# EAGLE schematic jtag-adapter-1-5 (EAGLE 8.4.3)
AUTHOR: Balazs Racz; DRAWING_TITLE: SWD adaptor board; REVISION: A; YEAR: 2018
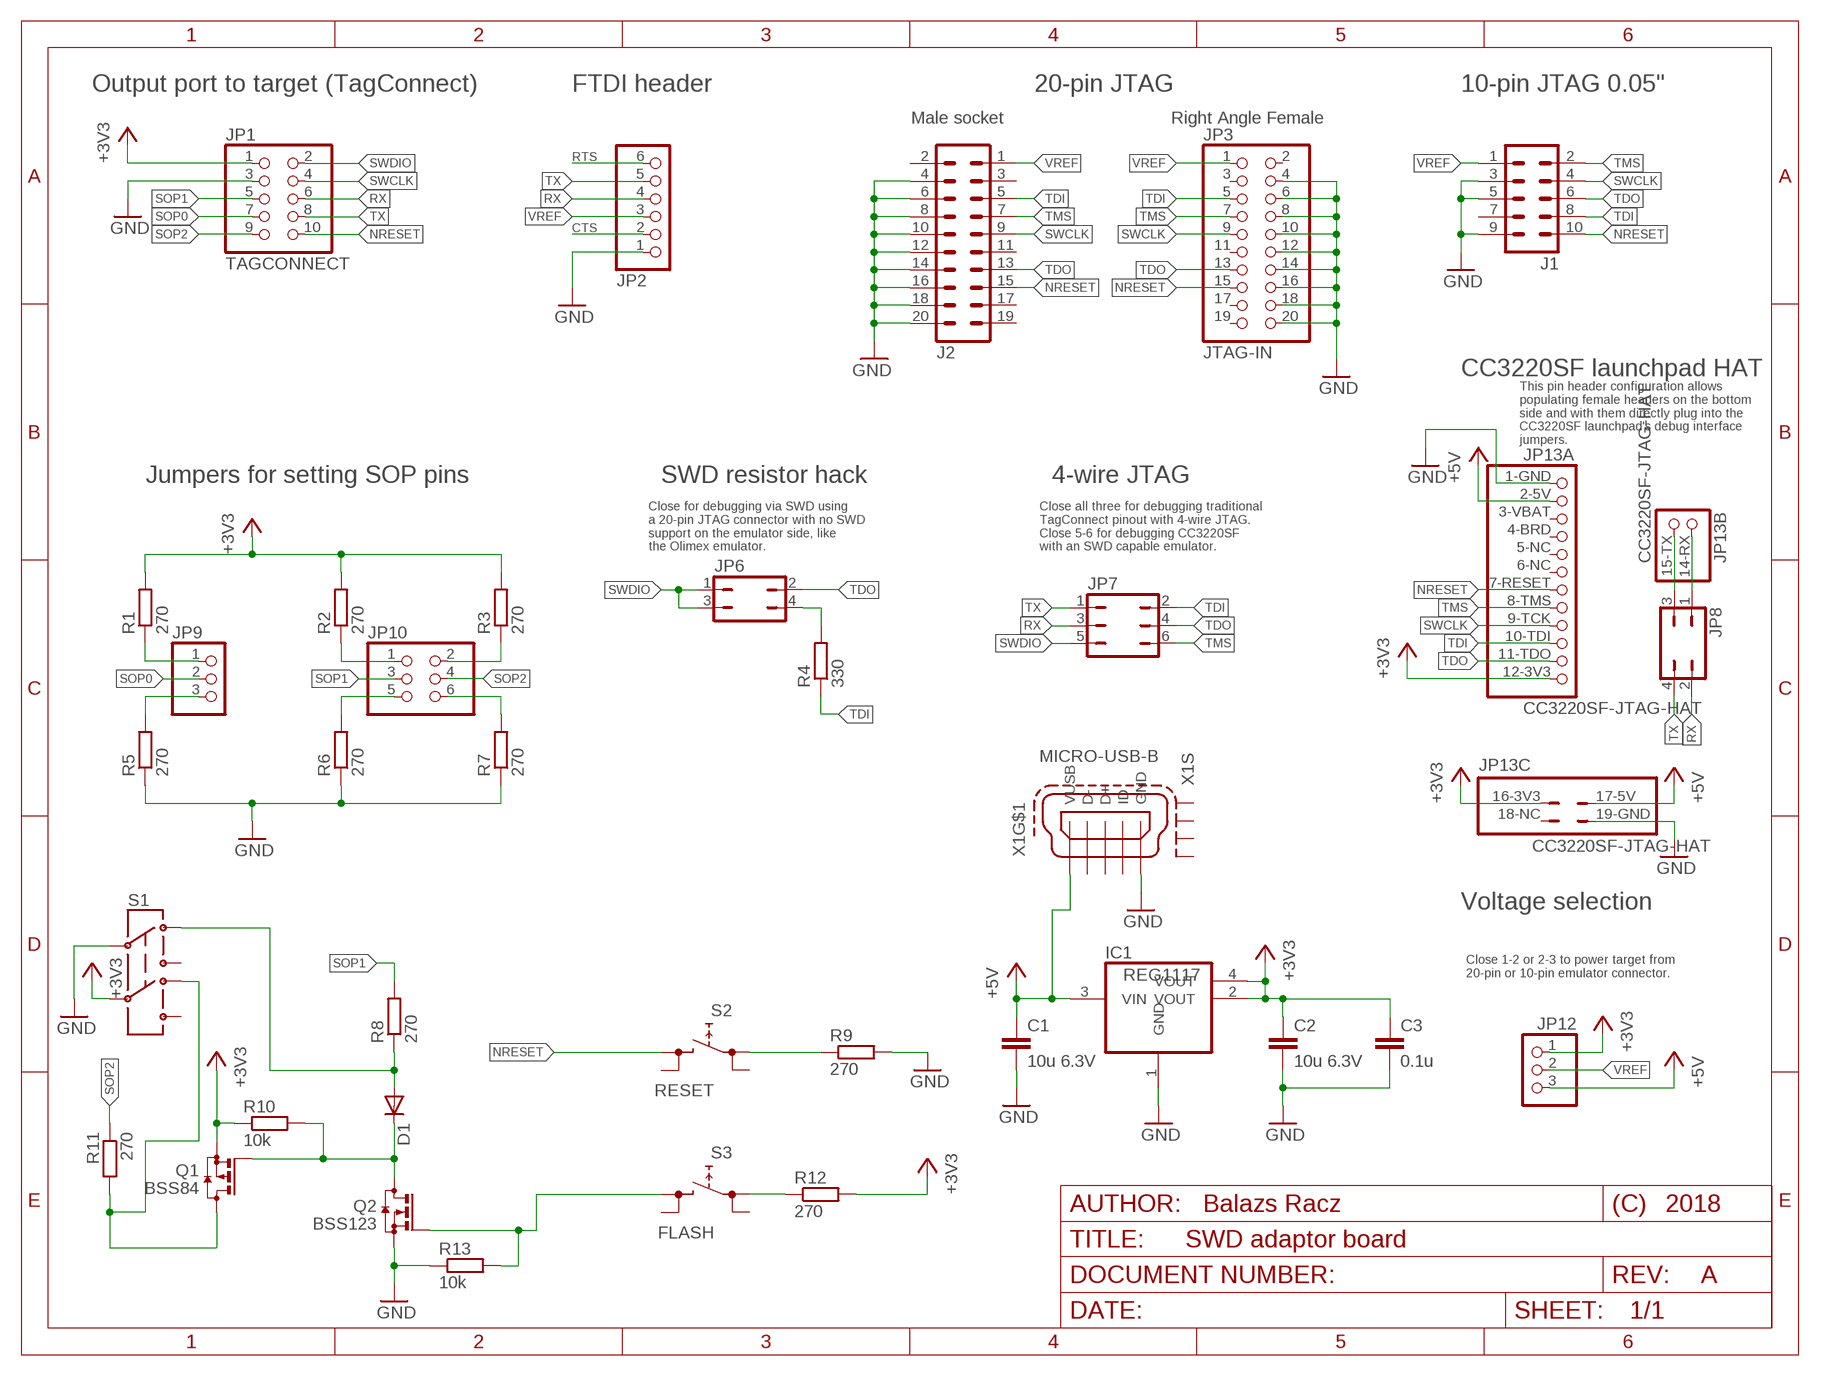
[diagram p0: schematic, sheet 1]

## Parts
C1  10u 6.3V  C-EUC0603K  [C0603K]
C2  10u 6.3V  C-EUC0603K  [C0603K]
C3  0.1u  C-EUC0603K  [C0603K]
D1  DIODE-MINIMELF  [MINIMELF]
IC1  REG1117  [SOT223]
J1  MA05-2_0.05X0.05  [MA05-2_0.05_X_0.05]
J2  MA10-2S  [MA10-2-SHROUDED]
JP1  TAGCONNECT  PINHD-2X5CN  [CON10M]
JP2  PINHD-1X6  [1X06]
JP3  JTAG-IN  PINHD-2X10/90  [2X10/90]
JP6  JP2Q  [JP2Q]
JP7  JP3Q  [JP3Q]
JP8  JP2Q  [JP2Q]
JP9  PINHD-1X3  [1X03]
JP10  PINHD-2X3  [2X03]
JP12  PINHD-1X3  [1X03]
JP13  CC3220SF-JTAG-HAT  [JTAG-LAUNCHPAD-3220SF]
Q1  BSS84  [SOT23]
Q2  BSS123  [SOT23]
R1  270  R-EU_R0805  [R0805]
R2  270  R-EU_R0805  [R0805]
R3  270  R-EU_R0805  [R0805]
R4  330  R-EU_R0805  [R0805]
R5  270  R-EU_R0805  [R0805]
R6  270  R-EU_R0805  [R0805]
R7  270  R-EU_R0805  [R0805]
R8  270  R-EU_R0805  [R0805]
R9  270  R-EU_R0805  [R0805]
R10  10k  R-EU_R0805  [R0805]
R11  270  R-EU_R0805  [R0805]
R12  270  R-EU_R0805  [R0805]
R13  10k  R-EU_R0805  [R0805]
S1  SWITCH-DPDTJS202011CQN  [DPDT-2.5X3.2MM]
S2  RESET  TACTSW-6X6S  [TACTSW-6X6]
S3  FLASH  TACTSW-6X6S  [TACTSW-6X6]
X1  MICRO-USB-B  [MICRO-B-PAC]

## Nets
+3V3: C2.1 C3.1 IC1.2(VOUT) IC1.4(VOUT) JP1.1 JP12.1 JP13.12-3V3 JP13.16-3V3 Q1.2(S) R1.2 R2.2 R3.2 R10.1 R12.2 S1.5(2C)
+5V: C1.1 IC1.3(VIN) JP12.3 JP13.2-5V JP13.17-5V X1.1(VUSB)
CTS: JP2.2
GND: C1.2 C2.2 C3.2 IC1.1(GND) J1.3 J1.5 J1.9 J2.4 J2.6 J2.8 J2.10 J2.12 J2.14 J2.16 J2.18 J2.20 JP1.3 JP2.1 JP3.4 JP3.6 JP3.8 JP3.10 JP3.12 JP3.14 JP3.16 JP3.18 JP3.20 JP13.1-GND JP13.19-GND Q2.2(S) R5.1 R6.1 R7.1 R9.2 R13.1 S1.2(1C) X1.5(GND)
N$1: R9.1 S2.1(1.1)
N$4: JP6.4 R4.2
N$9: D1.C Q1.1(G) Q2.3(D) R10.2
N$10: R12.1 S3.1(1.1)
N$11: Q2.1(G) R13.2 S3.3(2.1)
N$13: Q1.3(D) R11.2 S1.4(2A)
N$14: JP8.1 JP13.14-RX
N$15: JP8.3 JP13.15-TX
N$16: D1.A R8.1 S1.1(1A)
NRESET: J1.10 J2.15 JP1.10 JP3.15 JP13.7-RESET S2.3(2.1)
RTS: JP2.6
RX: JP1.6 JP2.4 JP7.3 JP8.2
SOP0: JP1.7 JP9.2
SOP0H: JP9.1 R1.1
SOP0L: JP9.3 R5.2
SOP1: JP1.5 JP10.3 R8.2
SOP1H: JP10.1 R2.1
SOP1L: JP10.5 R6.2
SOP2: JP1.9 JP10.4 R11.1
SOP2H: JP10.2 R3.1
SOP2L: JP10.6 R7.2
SWCLK: J1.4 J2.9 JP1.4 JP3.9 JP13.9-TCK
SWDIO: JP1.2 JP6.1 JP6.3 JP7.5
TDI: J1.8 J2.5 JP3.5 JP7.2 JP13.10-TDI R4.1
TDO: J1.6 J2.13 JP3.13 JP6.2 JP7.4 JP13.11-TDO
TMS: J1.2 J2.7 JP3.7 JP7.6 JP13.8-TMS
TX: JP1.8 JP2.5 JP7.1 JP8.4
VREF: J1.1 J2.1 JP2.3 JP3.1 JP12.2
Unconnected: J1.7 J2.2 J2.3 J2.11 J2.17 J2.19 JP3.2 JP3.3 JP3.11 JP3.17 JP3.19 JP13.3-VBAT JP13.4-BRD JP13.5-NC JP13.6-NC JP13.18-NC S1.3(1B) S1.6(2B) S2.2(1.2) S2.4(2.2) S3.2(1.2) S3.4(2.2) X1.2(D-) X1.3(D+) X1.4(ID) X1.M1(S:S1) X1.M2(S:S2) X1.M3(S:S3) X1.M4(S:S4)

## Notes on the sheet
- Output port to target (TagConnect) | FTDI header | 20-pin JTAG | 10-pin JTAG 0.05"
- Male socket | Right Angle Female
- CC3220SF launchpad HAT
- This pin header configuration allows
  populating female headers on the bottom
  side and with them directly plug into the 
  CC3220SF launchpad's debug interface
  jumpers.
- Jumpers for setting SOP pins | SWD resistor hack | 4-wire JTAG
- Close for debugging via SWD using
  a 20-pin JTAG connector with no SWD
  support on the emulator side, like
  the Olimex emulator.
- Close all three for debugging traditional
  TagConnect pinout with 4-wire JTAG.
  Close 5-6 for debugging CC3220SF
  with an SWD capable emulator.
- Voltage selection
- Close 1-2 or 2-3 to power target from
  20-pin or 10-pin emulator connector.

## Library data of the parts
C1-C3 = resistor:C-EU: CAPACITOR, European symbol
D1 = diode:DIODE-: DIODE
IC1 = trainlib:REG1117: 800mA and 1A Low Dropout (LDO) Positive Regulator 1.8V, 2.5V, 2.85V, 3.3V, 5V, and Adj; MPN: REG1117; OC_FARNELL: 1097566; OC_NEWARK: 14P6981
J1 = trainlib:MA05-2: PIN HEADER
J2 = tcs:MA10-2: PIN HEADER
JP1 = trainlib:PINHD-2X5: PIN HEADER
JP2 = pinhead:PINHD-1X6: PIN HEADER
JP3 = pinhead:PINHD-2X10: PIN HEADER
JP6 = trainlib:JP2Q: JUMPER
JP7 = trainlib:JP3Q: JUMPER
JP8 = jumper:JP2Q: JUMPER
JP9 JP12 = adafruit:PINHD-1X3: PIN HEADER
JP10 = pinhead:PINHD-2X3: PIN HEADER
JP13 = trainlib:CC3220SF-JTAG-HAT
Q1 = trainlib:BSS84: P-CHANNEL MOS FET
Q2 = transistor-small-signal:BSS123: N-CHANNEL MOS FET
R1-R13 = rcl:R-EU_: RESISTOR, European symbol
S1 = trainlib:SWITCH-DPDT: DPDT Version of the COM-00597
S2 S3 = trainlib:TACTSW-6X6: 6.2 X 6.5mm TACT Switch (SMD) Source: http://www3.alps.co.jp/WebObjects/catalog.woa/PDF/E/Switch/Tact/SKHM/SKHM.PDF
X1 = g-e2e-training:MICRO-USB-B: MINI USB-B Conector Source: www.cypressindustries.com

## Net classes
1 pwr: width 0.254 mm